# Altium schematic sheet DCI_MB1137.SchDoc
size 420 x 297 mm; ENG_APP_DATE: --/--/--; DSN_APP_DATE: --/--/--; CHK_APP_DATE: --/--/--
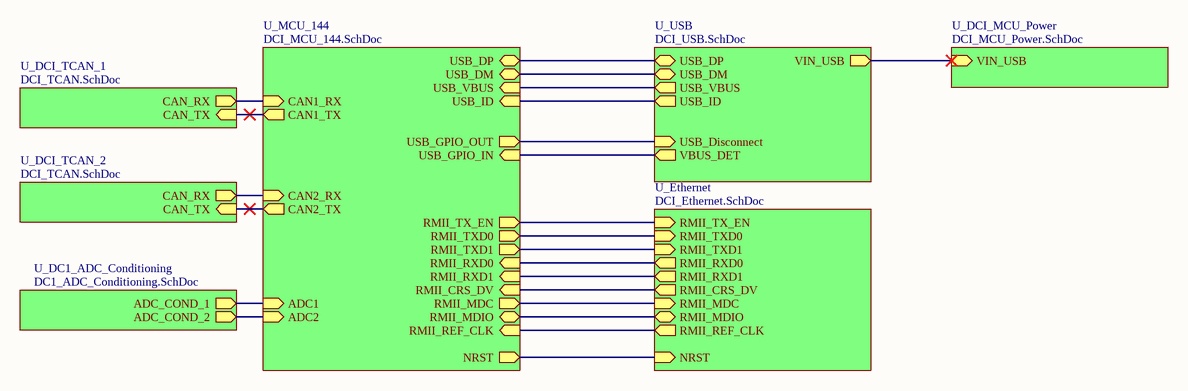
[diagram p0: DCI_MB1137.SchDoc]

## Sub-sheets
U_DC1_ADC_Conditioning = DC1_ADC_Conditioning.SchDoc: ADC_COND_1 (out), ADC_COND_2 (out)
U_DCI_MCU_Power = DCI_MCU_Power.SchDoc: VIN_USB (in)
U_DCI_TCAN_1 = DCI_TCAN.SchDoc: CAN_TX (in), CAN_RX (out)
U_DCI_TCAN_2 = DCI_TCAN.SchDoc: CAN_TX (in), CAN_RX (out)
U_Ethernet = DCI_Ethernet.SchDoc: RMII_TXD0 (in), RMII_TX_EN (in), RMII_RXD0 (out), RMII_REF_CLK (out), RMII_CRS_DV (out), RMII_MDC (in), RMII_MDIO (bidir), NRST (in), RMII_TXD1 (in), RMII_RXD1 (out)
U_MCU_144 = DCI_MCU_144.SchDoc: NRST (out), USB_DM (bidir), USB_DP (bidir), USB_GPIO_OUT (out), USB_GPIO_IN (in), USB_ID (in), USB_VBUS (in), RMII_TXD0 (out), RMII_TX_EN (out), RMII_RXD0 (in), RMII_REF_CLK (in), RMII_CRS_DV (in), RMII_MDC (out), RMII_MDIO (bidir), RMII_TXD1 (out), RMII_RXD1 (in), ADC1 (in), ADC2 (in), CAN1_RX (in), CAN1_TX (out), CAN2_TX (out), CAN2_RX (in)
U_USB = DCI_USB.SchDoc: USB_DM (bidir), USB_DP (bidir), USB_ID (out), USB_VBUS (out), USB_Disconnect (in), VBUS_DET (out), VIN_USB (out)

## Nets
(unnamed): sheet U_Ethernet/RMII_TXD0, sheet U_MCU_144/RMII_TXD0
(unnamed): sheet U_Ethernet/RMII_TX_EN, sheet U_MCU_144/RMII_TX_EN
(unnamed): sheet U_Ethernet/RMII_RXD0, sheet U_MCU_144/RMII_RXD0
(unnamed): sheet U_Ethernet/RMII_REF_CLK, sheet U_MCU_144/RMII_REF_CLK
(unnamed): sheet U_Ethernet/RMII_CRS_DV, sheet U_MCU_144/RMII_CRS_DV
(unnamed): sheet U_Ethernet/RMII_MDC, sheet U_MCU_144/RMII_MDC
(unnamed): sheet U_Ethernet/RMII_MDIO, sheet U_MCU_144/RMII_MDIO
(unnamed): sheet U_Ethernet/NRST, sheet U_MCU_144/NRST
(unnamed): sheet U_Ethernet/RMII_TXD1, sheet U_MCU_144/RMII_TXD1
(unnamed): sheet U_Ethernet/RMII_RXD1, sheet U_MCU_144/RMII_RXD1
(unnamed): sheet U_MCU_144/USB_DM, sheet U_USB/USB_DM
(unnamed): sheet U_MCU_144/USB_DP, sheet U_USB/USB_DP
(unnamed): sheet U_MCU_144/USB_GPIO_OUT, sheet U_USB/USB_Disconnect
(unnamed): sheet U_MCU_144/USB_GPIO_IN, sheet U_USB/VBUS_DET
(unnamed): sheet U_MCU_144/USB_ID, sheet U_USB/USB_ID
(unnamed): sheet U_MCU_144/USB_VBUS, sheet U_USB/USB_VBUS
(unnamed): sheet U_MCU_144/ADC1, sheet U_DC1_ADC_Conditioning/ADC_COND_1
(unnamed): sheet U_MCU_144/ADC2, sheet U_DC1_ADC_Conditioning/ADC_COND_2
(unnamed): sheet U_MCU_144/CAN1_RX, sheet U_DCI_TCAN_1/CAN_RX
(unnamed): sheet U_MCU_144/CAN1_TX, sheet U_DCI_TCAN_1/CAN_TX
(unnamed): sheet U_MCU_144/CAN2_TX, sheet U_DCI_TCAN_2/CAN_TX
(unnamed): sheet U_MCU_144/CAN2_RX, sheet U_DCI_TCAN_2/CAN_RX
(unnamed): sheet U_USB/VIN_USB, sheet U_DCI_MCU_Power/VIN_USB

## Notes on the sheet
- MEMBERS:
- Universitat Politècnica de València
- - Gianmarco Leopoldo Sangoi
- - Vicente Beltrán Morte
- PROJECT:
- SIZE:
- FILE NAME:
- A3
- NUMBER:
- 1
- REVISION:
- A1
- DATE:
- 07/05/2022
- SHEET
- OF
- 7